# EAGLE design Hand Module (EAGLE 7.3.0)
CNAME: Elektronika dan Instrumentasi UGM; CREVISION: 8; DESIGNER: Ilham, Ahmad, Piquitha
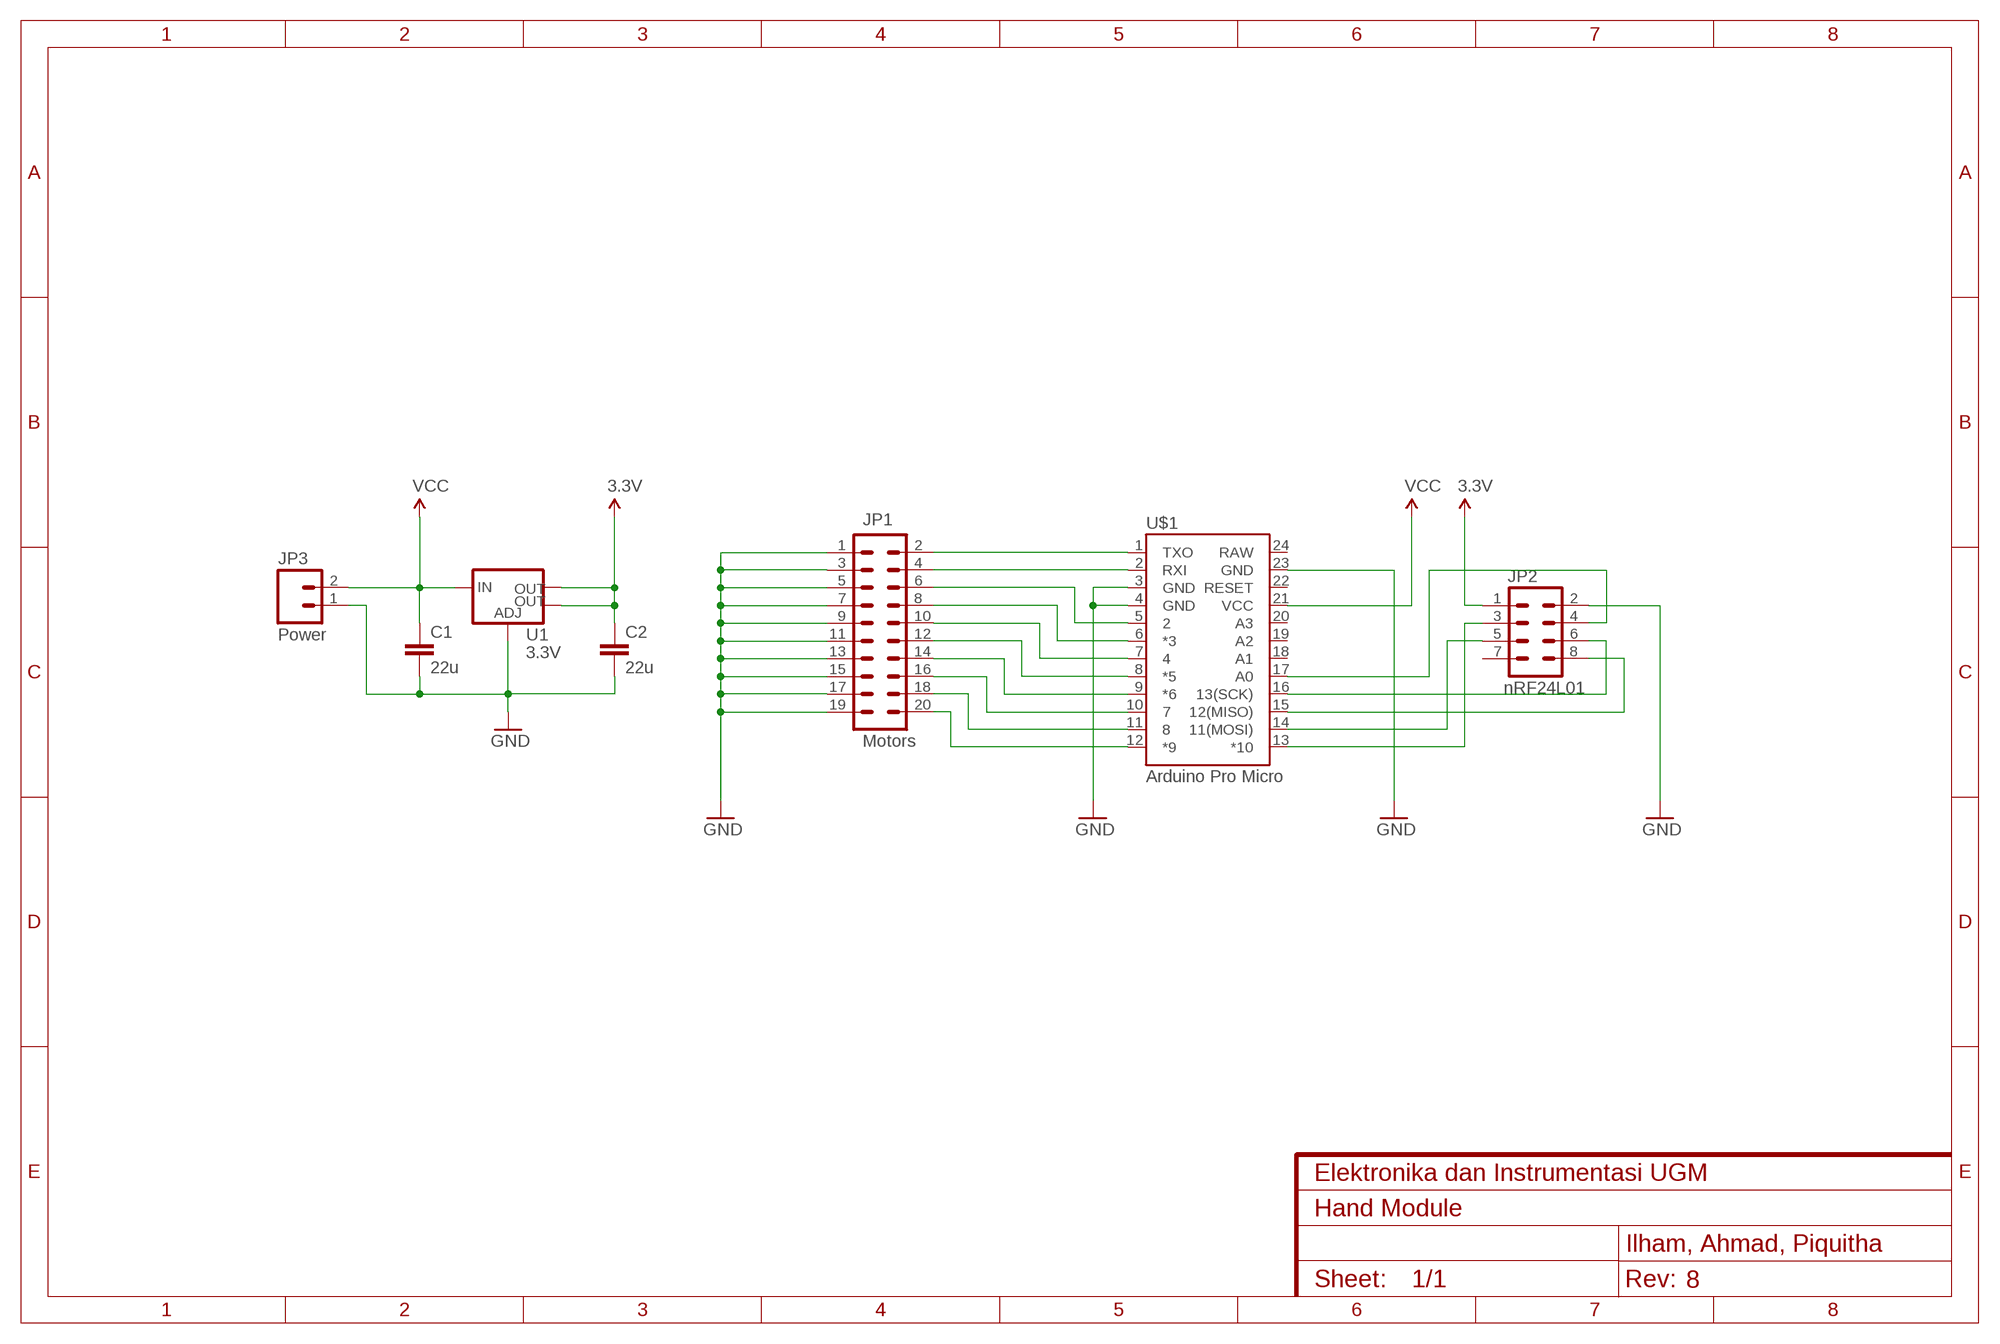
[diagram p0: schematic, sheet 1]

## Parts
C1  22u  CAP0805  [0805]
C2  22u  CAP0805  [0805]
JP1  Motors  M10X2  [2X10]
JP2  nRF24L01  M04X2  [2X4]
JP3  Power  M02PTH  [1X02]
U1  3.3V  V_REG_LM1117SOT223  [SOT223]
U$1  Arduino Pro Micro  ARDUINO_PRO_MICRO  [ARDUINO_PRO_MICRO]

## Nets
1: JP1.2 U$1.1(TXO)
2: JP1.4 U$1.2(RXI)
3: JP1.6 U$1.5
3.3V: C2.1 JP2.1 U1.2(OUT) U1.4(OUT)
4: JP1.8 U$1.6(*3)
5: JP1.10 U$1.7
6: JP1.12 U$1.8(*5)
7: JP1.14 U$1.9(*6)
8: JP1.16 U$1.10
9: JP1.18 U$1.11
10: JP1.20 U$1.12(*9)
GND: C1.2 C2.2 JP1.1 JP1.3 JP1.5 JP1.7 JP1.9 JP1.11 JP1.13 JP1.15 JP1.17 JP1.19 JP2.2 JP3.1 U1.1(ADJ) U$1.3(GND) U$1.4(GND) U$1.23(GND)
MISO: JP2.8 U$1.15(12(MISO))
MOSI: JP2.5 U$1.14(11(MOSI))
N$1: JP2.3 U$1.13(*10)
N$2: JP2.4 U$1.17(A0)
SCK: JP2.6 U$1.16(13(SCK))
VCC: C1.1 JP3.2 U1.3(IN) U$1.21(VCC)
Unconnected: JP2.7 U$1.18(A1) U$1.19(A2) U$1.20(A3) U$1.22(RESET) U$1.24(RAW)

## Library data of the parts
C1 C2 = SparkFun-Capacitors:CAP: Capacitor Standard 0603 ceramic capacitor, and 0.1" leaded capacitor.
JP1 = SparkFun-Connectors:M10X2: This was SPECIALLY designed to be used with our Graphic LCD Backpack. Be sure you want to use this! It is not only staggered on each line of header holes, but IT IS ALSO offset of the center point of the top and bottom lines by 5 mil. This causes the headers to lock into place on the "standard" footprint on the LCD screen. The extra squares on the tdocu layer are there simply to reference other pins (if you were to actually populate a longer header than ten long - this is what we do with the backpacks).
JP2 = SparkFun-Connectors:M04X2: .1" header, two rows of four.
JP3 = SparkFun-Connectors:M02: Standard 2-pin 0.1" header. Use with - straight break away headers ( PRT-00116) - right angle break away headers (PRT-00553) - swiss pins (PRT-00743) - machine pins (PRT-00117) - female headers (PRT-00115) Molex polarized connector foot print use with: PRT-08233 with associated crimp pins and housings. 2.54_SCREWTERM for use with PRT-10571. 3.5mm Screw Terminal footprints for PRT-08084 5mm Screw Terminal footprints for use with PRT-08432
U1 = SparkFun-PowerIC:V_REG_LM1117: Voltage Regulator LM1117 Standard adjustable voltage regulator but in SMD form. Spark Fun Electronics SKU : COM-00595; PROD_ID: VREG-08170
U$1 = SparkFun-Boards:ARDUINO_PRO_MICRO

## Board
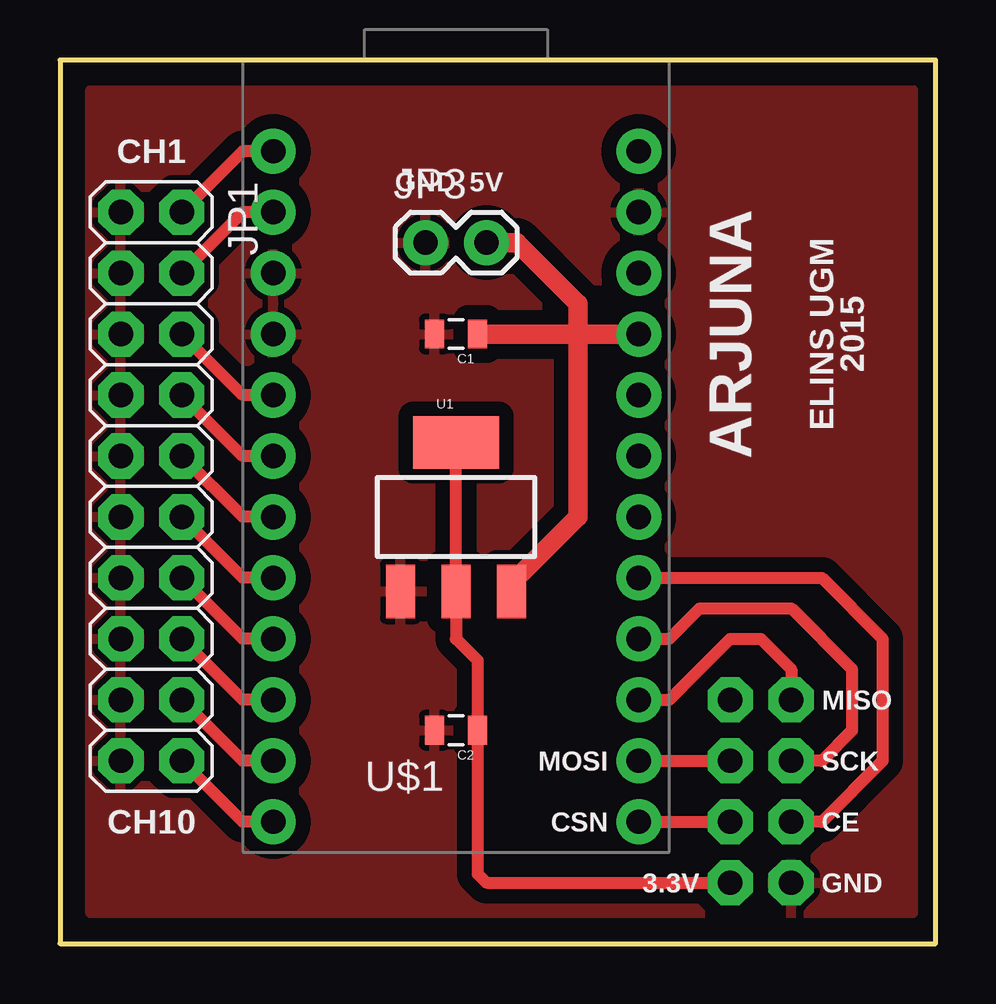
[diagram p1: board, top side]
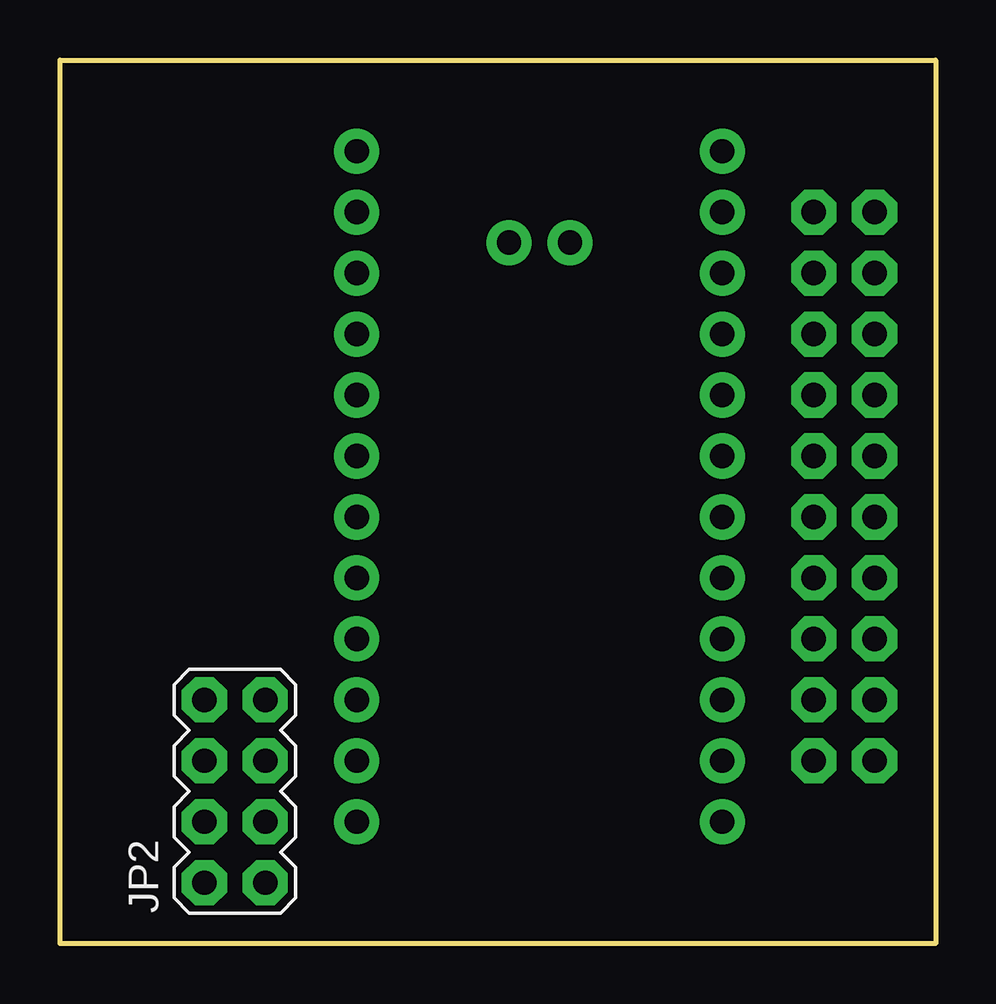
[diagram p2: board, bottom side, seen from below]

Size 36.5 x 36.82 mm. Coordinates in mm from the lower left corner, seen from the top.
Outline: 0,0 36.5,0 36.5,36.82 0,36.82 0,0
Copper layers (1*16): Top 0.035mm / dielectric 1.5mm / Bottom 0.035mm
Design rules "SparkFun-2-layer": minimum track width 7mil, minimum drill 15mil, track to track 8mil, track to pad 8mil, pad to pad 8mil, via to via 8mil, smd to smd 8mil, copper to edge 8mil, drill to drill 8mil, minimum pad ring 12mil, minimum via ring 10mil, stop-mask expansion 4mil, vias tented up to drill 20mil, thermal gap 10mil

### Footprints (pad centres in the part's own frame; a part is rotated, then mirrored left to right if it is on the bottom)
0805 = smd 0.8 x 1.2: 1 -0.9,0; 2 0.9,0
2X10 = drill 1.016 pad 1.88 octagon: 1 -11.43,-1.27; 2 -11.43,1.27; 3 -8.89,-1.27; 4 -8.89,1.27; 5 -6.35,-1.27; 6 -6.35,1.27; 7 -3.81,-1.27; 8 -3.81,1.27; 9 -1.27,-1.27; 10 -1.27,1.27; 11 1.27,-1.27; 12 1.27,1.27; 13 3.81,-1.27; 14 3.81,1.27; 15 6.35,-1.27; 16 6.35,1.27; 17 8.89,-1.27; 18 8.89,1.27; 19 11.43,-1.27; 20 11.43,1.27
2X4 = drill 1.016 pad 1.88 octagon: 1 -3.81,-1.27; 2 -3.81,1.27; 3 -1.27,-1.27; 4 -1.27,1.27; 5 1.27,-1.27; 6 1.27,1.27; 7 3.81,-1.27; 8 3.81,1.27
1X02 = drill 1.016 pad 1.88: 1 0,0; 2 2.54,0
SOT223 = smd 1.219 x 2.235: 1 -2.311,-3.099; 2 0,-3.099; 3 2.311,-3.099 | smd 3.6 x 2.2: 4 0,3.099
ARDUINO_PRO_MICRO = drill 1.016 pad 1.88: 1 -7.62,12.7; 2 -7.62,10.16; 3 -7.62,7.62; 4 -7.62,5.08; 5 -7.62,2.54; 6 -7.62,0; 7 -7.62,-2.54; 8 -7.62,-5.08; 9 -7.62,-7.62; 10 -7.62,-10.16; 11 -7.62,-12.7; 12 -7.62,-15.24; 13 7.62,-15.24; 14 7.62,-12.7; 15 7.62,-10.16; 16 7.62,-7.62; 17 7.62,-5.08; 18 7.62,-2.54; 19 7.62,0; 20 7.62,2.54; 21 7.62,5.08; 22 7.62,7.62; 23 7.62,10.16; 24 7.62,12.7

### Placement (x,y rotation side)
C1  16.51,25.4 180 top
C2  16.51,8.89 180 top
JP1  3.81,19.05 270 top
JP2  29.21,6.35 90 bottom
JP3  15.24,29.21 0 top
U1  16.51,17.78 0 top
U$1  16.51,20.32 0 top

### Tracks (layer width: path | path; a pad name or v marks a point on that pad's centre or on a via)
1
  Top 0.5: U$1.1 7.62,33.02 JP1.2
2
  Top 0.5: U$1.2 7.62,30.48 JP1.4
3
  Top 0.5: U$1.5 7.62,22.86 JP1.6
3.3V
  Top 0.5: U1.4 U1.2 16.51,12.7 17.41,11.8 C2.1 17.41,2.91 17.78,2.54 JP2.1
4
  Top 0.5: U$1.6 7.62,20.32 JP1.8
5
  Top 0.5: U$1.7 7.62,17.78 JP1.10
6
  Top 0.5: U$1.8 7.62,15.24 JP1.12
7
  Top 0.5: U$1.9 7.62,12.7 JP1.14
8
  Top 0.5: U$1.10 7.62,10.16 JP1.16
9
  Top 0.5: U$1.11 7.62,7.62 JP1.18
10
  Top 0.5: U$1.12 7.62,5.08 JP1.20
GND
  pour Top (isolate 0.61): 1.27,35.56 35.56,35.56 35.56,1.27 1.27,1.27
MISO
  Top 0.5: U$1.15 25.4,10.16 27.94,12.7 29.21,12.7 30.48,11.43 JP2.8
MOSI
  Top 0.5: U$1.14 JP2.5
N$1
  Top 0.5: U$1.13 JP2.3
N$2
  Top 0.5: U$1.17 31.75,15.24 34.29,12.7 34.29,7.62 31.75,5.08 JP2.4
SCK
  Top 0.5: U$1.16 25.4,12.7 26.67,13.97 30.48,13.97 33.02,11.43 33.02,8.89 31.75,7.62 JP2.6
VCC
  Top 0.5: U1.3 18.82,15.01 19.05,15.24
  Top 0.813: 22.86,25.4 U$1.21 21.59,25.4 | 21.59,25.4 21.59,17.78 19.05,15.24 | C1.1 21.59,25.4 | JP3.2 19.05,29.21 21.59,26.67 21.59,25.4

### Text on the board
tPlace: CH1 | GND | 5V | ARJUNA | ELINS UGM | 2015 | MISO | MOSI | SCK | CH10 | CSN | CE | 3.3V | GND